# Altium project PCB_Project.PrjPcb
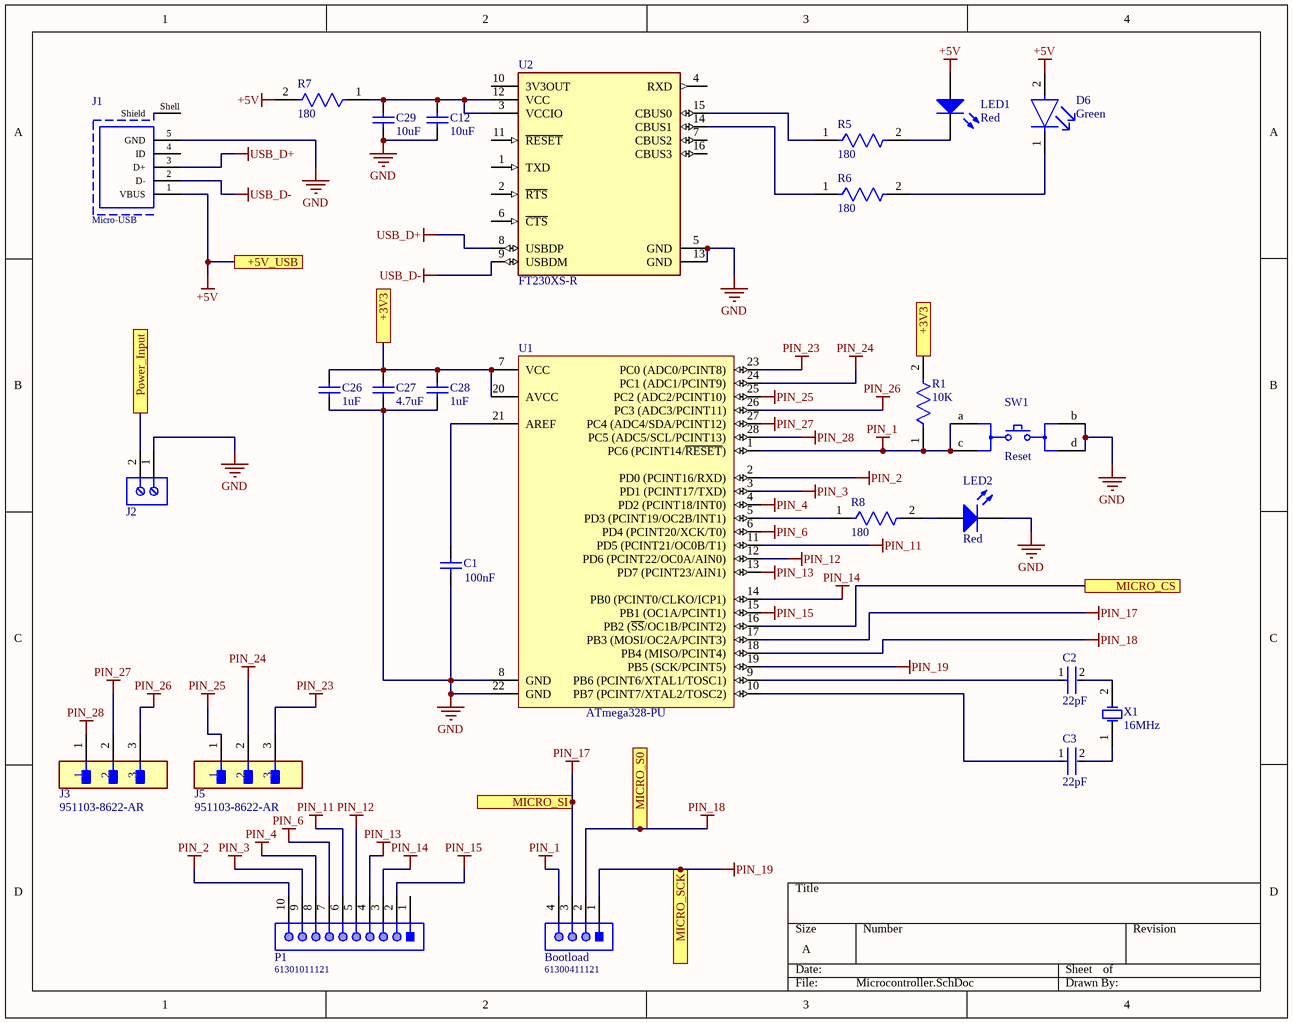
[diagram p0: Microcontroller.SchDoc]
4 sheets, 61 parts. Net scope: flat (ports and power ports of the same name join across sheets).
Board file: PCB1.PcbDoc
Sheets:
  Microcontroller.SchDoc
  Peripherals.SchDoc
  Power Delivery.SchDoc
  WiFi.SchDoc

## Sheet Microcontroller.SchDoc
size A

### Parts
Bootload  61300411121  [61300411121]
C1  100nF  [CAPC2013X140X50NL20T25]
C2  22pF  [FP-C0805C-DN-MFG]
C3  22pF  [FP-C0805C-DN-MFG]
C12  10uF  [CAPC2013X115X51LL20T26]
C26  1uF  [CAPC2013X94X50LL20T25]
C27  4.7uF  [CAPC2013X140X50LL20T25]
C28  1uF  [CAPC2013X94X50LL20T25]
C29  10uF  [CAPC2013X115X51LL20T26]
D6  Green  [FP-APTD3216CGCK-MFG]
J1  Micro-USB  [629105150921]
J2  (no value)  [691214110002]
J3  951103-8622-AR  [FP-951103-8622-AR-MFG]
J5  951103-8622-AR  [FP-951103-8622-AR-MFG]
LED1  Red  [0603_A]
LED2  Red  [0603_A]
P1  61301011121  [61301011121]
R1  10K  [FP-CRCW0805-e3-IPC_A]
R5  180  [FP-CR0805-MFG]
R6  180  [FP-CR0805-MFG]
R7  180  [FP-CR0805-MFG]
R8  180  [FP-CR0805-MFG]
SW1  Reset  [FP-ESE-20C421-MFG]
U1  ATmega328-PU  [28P3]
U2  FT230XS-R  [FP-SSOP-16-MFG]
X1  16MHz  [FOX-FOXSDLF160-20_V]

### Ports
+3V3, +5V_USB, MICRO_CS, MICRO_S0, MICRO_SCK, MICRO_SI, Power_Input

### Nets
+3V3: C26.2 C27.2 C28.2 R1.2 U1.7(VCC) U1.20(AVCC) ; port +3V3
+5V: D6.2(A) J1.1(VBUS) LED1.2(A) R7.2 ; port +5V_USB
GND: C1.1 C12.1 C26.1 C27.1 C28.1 C29.1 J1.5(GND) J2.1 LED2.1(K) SW1.b SW1.d U1.8(GND) U1.22(GND) U2.5(GND) U2.13(GND)
PIN_1: Bootload.4 R1.1 SW1.a SW1.c U1.1(PC6_(PCINT14/~{RESET}))
PIN_2: P1.10 U1.2(PD0_(PCINT16/RXD))
PIN_3: P1.9 U1.3(PD1_(PCINT17/TXD))
PIN_4: P1.8 U1.4(PD2_(PCINT18/INT0))
PIN_6: P1.7 U1.6(PD4_(PCINT20/XCK/T0))
PIN_11: P1.6 U1.11(PD5_(PCINT21/OC0B/T1))
PIN_12: P1.5 U1.12(PD6_(PCINT22/OC0A/AIN0))
PIN_13: P1.4 U1.13(PD7_(PCINT23/AIN1))
PIN_14: P1.3 U1.14(PB0_(PCINT0/CLKO/ICP1))
PIN_15: P1.2 U1.15(PB1_(OC1A/PCINT1))
PIN_17: Bootload.3 U1.17(PB3_(MOSI/OC2A/PCINT3)) ; port MICRO_SI
PIN_18: Bootload.2 U1.18(PB4_(MISO/PCINT4)) ; port MICRO_S0
PIN_19: Bootload.1 U1.19(PB5_(SCK/PCINT5)) ; port MICRO_SCK
PIN_23: J5.3 U1.23(PC0_(ADC0/PCINT8))
PIN_24: J5.2 U1.24(PC1_(ADC1/PCINT9))
PIN_25: J5.1 U1.25(PC2_(ADC2/PCINT10))
PIN_26: J3.3 U1.26(PC3_(ADC3/PCINT11))
PIN_27: J3.2 U1.27(PC4_(ADC4/SDA/PCINT12))
PIN_28: J3.1 U1.28(PC5_(ADC5/SCL/PCINT13))
USB_D+: J1.3(D+) U2.8(USBDP)
USB_D-: J1.2(D-) U2.9(USBDM)
VIN: J2.2 ; port Power_Input
NetC1_2: C1.2 U1.21(AREF)
NetC2_1: C2.1 U1.9(PB6_(PCINT6/XTAL1/TOSC1))
NetC2_2: C2.2 X1.2(X2)
NetC3_1: C3.1 U1.10(PB7_(PCINT7/XTAL2/TOSC2))
NetC3_2: C3.2 X1.1(X1)
NetC12_2: C12.2 C29.2 R7.1 U2.3(VCCIO) U2.12(VCC)
NetD6_1: D6.1(C) R6.2
NetLED1_1: LED1.1(K) R5.2
NetLED2_2: LED2.2(A) R8.2
NetR5_1: R5.1 U2.15(CBUS0)
NetR6_1: R6.1 U2.14(CBUS1)
NetR8_1: R8.1 U1.5(PD3_(PCINT19/OC2B/INT1))
NetU1_16: U1.16(PB2_(~{SS}/OC1B/PCINT2)) ; port MICRO_CS

Not connected (* = marked no-connect by the designer): J1 4(ID) Shell(Shield); P1 1; U2 1(TXD) 2(~{RTS}) 4(RXD) 6(~{CTS}) 7(CBUS2) 10(3V3OUT) 11(~{RESET}) 16(CBUS3)

### Library data of the parts
Bootload = CMP-1502-01064-1: THT Vertical Pin Header WR-PHD, Pitch 2.54 mm, Single Row, 4 pins; Manufacturer: Wurth Elektronik; Withstanding Voltage: 500VAC; Rated Current: 3A; Working Voltage: 250VAC; Pin Number: 4; Gender: Male; Contact Resistance: 20mOhm; Pitch: 2.54mm; Manufacturer URL: http://www.we-online.de; Operating Temperature: -40to105degC; Packaging: Bag; Mounting Technology: THT; Package Reference: 61300411121; Datasheet URL: https://katalog.we-online.de/em/datasheet/6130xx11121.pdf; Publisher: WurthElektronik; Part Number: 61300411121; Row Number: Single; Orientation: Vertical
C1 = CMP-2007-04629-1: Part Number: 08055C104K4Z2A; Manufacturer: AVX Interconnect / Elco
C2 C3 = CMP-2007-00448-2: CAP CER 22PF 100V 5% NP0 0805; Manufacturer Part Number: C0805C220J1GACTU; Manufacturer: KEMET; Material: Ceramic; Temperature Coefficient: 30ppm/°C; Tolerance: 0.05; Temperature Characteristic: C0G; Value: 22 pF; RoHS: TRUE; ComponentLink2URL: https://content.kemet.com/datasheets/KEM_C1003_C0G_SMD.pdf; Capacitance: 22 pF; Mouser Description: Multilayer Ceramic Capacitor, C Series, 22 Pf, - 5%, C0g / Np0, 100 V, 0805 [2012 Metric] Rohs Compliant: Yes; Digikey Description: CAP CER 22PF 100V 5% NP0 0805; Octopart: https://octopart.com/c0805c220j1gactu-kemet-3791395; Device Class L3: Ceramic Capacitors; Device Class L2: Capacitors; Voltage Rating: 100 V; Temperature Range Low: -55°C; Ipc Land Pattern Name: CAPC200125X78; Lead Free: Yes; ComponentLink2Description: Datasheet; Category: Cap; Temperature: -55°C to +125°C; Package: C0805C-DN; Device Class L1: Passive Components; Temperature Range High: +125°C; Height: 0.88mm; Automotive: No
C12 C29 = CMP-2007-04884-1: Manufacturer: AVX Interconnect / Elco; Part Number: 08056C106KAT2A
C26 C28 = CMP-2007-04237-1: Manufacturer: AVX Interconnect / Elco; Part Number: 08053C105K4T2A
C27 = CMP-1036-04896-2: Manufacturer: AVX Interconnect / Elco; Part Number: 08053D475MAT2A
D6 = CMP-2000-05792-2: LED GREEN CLEAR 2SMD; Forward Voltage: 2.1V; Forward Current: 20mA; Luminous Intensity: 300mcd; Number of LEDs: 1; Dominant Wavelength: 570nm; Viewing Angle: 50°; Lead Free: Lead Free; Lens Color: Clear; Mount: Surface Mount; Package Quantity: 2000; Height: 1.8mm; Number of Pins: 2; Test Current: 20mA; Case Code (Metric): 3216; Case/Package: 1206; Case Code (Imperial): 1206; Illumination Color: Green; Color: Green; Width: 1.6mm; Packaging: Tape and Reel; Min Operating Temperature: -40°C; Lens Style: Clear; Max Operating Temperature: 85°C; Length: 3.2mm
J1 = CMP-1502-03249-1: Micro USB 2.0 Type AB Receptacle WR-COM, Horizontal, SMT; Manufacturer: Wurth Elektronik; Rated Current: 1.8A; Contact Resistance: 30mOhm; Working Voltage: 30VAC; Publisher: WurthElektronik; Part Number: 629105150921; Operating Temperature: -40to85degC; Gender: Receptacle; Packaging: TapeandReel; Connector Type: MicroUSB2.0TypeAB; Datasheet URL: https://katalog.we-online.de/em/datasheet/629105150921.pdf; Mounting Technology: SMT; Orientation: Horizontal; Package Reference: 629105150921; Manufacturer URL: http://www.we-online.de
J2 = CMP-1502-02464-1: Serie 2141 - 3.50 mm Horizontal Entry Modular with Rising Cage Clamp WR-TBL, 2 pin; Manufacturer: Wurth Elektronik; Pin Number: 2; Pitch: 3.50mm; Datasheet URL: http://katalog.we-online.de/em/datasheet/6912141100xx.pdf; Packaging: Box; Mounting Technology: THT; Package Reference: 691214110002; Manufacturer URL: http://www.we-online.de; Part Number: 691214110002; Publisher: WurthElektronik; Operating Temperature: -40to105degC
J3 J5 = CMP-05379-000003-1: CONN HEADER VERT 3POS 2MM; Manufacturer: 3M; Conn Gender: Male; Current Rating: 2A; Number Of Contacts: 3; Conn Orientation: Straight; Digikey Description: CONN HEADER VERT 3POS 2MM; Device Class L3: unset; Category: Conn; Height: 6.3mm; Manufacturer Part Number: 951103-8622-AR; RoHS: TRUE; Contact Material: Gold,Nickel; ComponentLink2Description: Datasheet; Temperature Range Low: -55°C; Device Class L1: Connectors; Pitch: 2mm; Mouser Description: Header; PinStrip; CopperAlloy; HighTempThermoplastic; 3Cnts; 1A; RtAngle; 951Series; Octopart: https://octopart.com/951103-8622-ar-3m-14400669; Package: 951103-8622-AR; Lead Free: Yes; Device Class L2: Headers and Wire Housings; Temperature Range High: +125°C; ComponentLink2URL: http://multimedia.3m.com/mws/media/1400506O/3m-pin-strip-header-951-series-78-5100-2653-3.pdf; Automotive: No; Temperature: -55°C to +125°C; Number Of Rows: 1
LED1 LED2 = CMP-1426-00001-1: SMD mono-color Chip LED, WL-SMCW, Red; Manufacturer: Wuerth Elektronik; PartNumber: 150060RS75000; Color: Red; PackageReference: 0603_A; ComponentLink2URL: http://katalog.we-online.com/led/datasheet/150060RS75000.pdf; ComponentLink1URL: http://www.we-online.com; ComponentLink1Description: Manufacturer URL; ComponentLink2Description: Datasheet
P1 = CMP-1502-01082-1: THT Vertical Pin Header WR-PHD, Pitch 2.54 mm, Single Row, 10 pins; Manufacturer: Wurth Elektronik; Contact Resistance: 20mOhm; Rated Current: 3A; Pitch: 2.54mm; Gender: Male; Pin Number: 10; Working Voltage: 250VAC; Withstanding Voltage: 500VAC; Manufacturer URL: http://www.we-online.de; Operating Temperature: -40to105degC; Datasheet URL: https://katalog.we-online.de/em/datasheet/6130xx11121.pdf; Row Number: Single; Orientation: Vertical; Part Number: 61301011121; Packaging: Bag; Package Reference: 61301011121; Mounting Technology: THT; Publisher: WurthElektronik
R1 = CMP-2001-04908-2: RES Thick Film, 10kΩ, 1%, 0.125W, 100ppm/°C, 0805; Resistance: 10kR; Voltage Rating (DC): 150V; Power Rating: 125mW; Weight: 0.000194oz; Package Quantity: 5000; Military Standard: Not; Max Operating Temperature: 155°C; Temperature Coefficient: 100ppm/°C; Contact Plating: Tin; Width: 1.25mm; Height: 0.45mm; Radiation Hardening: No; Tolerance: 1%; Min Operating Temperature: -55°C; Voltage Rating: 150V; Length: 2mm; Depth: 1.25mm; Termination: SMD/SMT; Packaging: Tape and Reel; Case/Package: 0805; Case Code (Metric): 2012; Lead Free: Lead Free; Case Code (Imperial): 0805; Composition: Thick Film
R5-R8 = CMP-07231-003557-1: Thick Film Chip Resistors 0805 180Ω 0.125W 5% 200ppm/°C; Voltage Rating: 150V; Power Rating: 125mW; Resistance: 180R; Radiation Hardening: No; Military Standard: Not; Case Code (Imperial): 0805; Length: 2mm; Termination: SMD/SMT; Thickness: 508um; Case Code (Metric): 2012; Packaging: Tape and Reel; Temperature Coefficient: 200ppm/°C; Max Operating Temperature: 155°C; Package Quantity: 5000; Case/Package: 0805; Contact Plating: Tin; Tolerance: 5%; Width: 1.25mm; Composition: Thick Film; Depth: 1.25mm; Mount: Surface Mount; Height: 0.5mm; Min Operating Temperature: -55°C
SW1 = CMP-05613-000006-1: SWITCH PUSH SPST-NO 0.1A 14V; Current Rating: 100mA; Switch Function: Off-Mom; Throw Configuration: SPST; Actuator Type: Lever; Operating Force: 4N; Actuator Length: 5.5mm; Series: ESE20C; Package Quantity: 1200; Radiation Hardening: No; Max Voltage Rating (DC): 14V; Voltage Rating (DC): 14V; Max Operating Temperature: 80°C; Lead Free: Lead Free; Mount: Through Hole; Termination: PC Pin; Packaging: Bulk; Min Operating Temperature: -30°C; RoHS Compliant: Yes; Contact Current Rating: 100mA; REACH SVHC: No SVHC; Orientation: Straight
U1 = CMP-0095-00015-2: 8-bit AVR Microcontroller, 32KB Flash, 1KB EEPROM, 2KB SRAM, 28-pin PDIP, Industrial Grade (-40°C to 85°C); ComponentLink3Description: ATmega48A/48PA/88A/88PA/168A/168PA/328/328P Summary; RevisionNote: DatasheetVersion updated. URLs added.; DatasheetVersion: revD, May-2011; ComponentLink1URL: http://www.atmel.com/; PackageVersion: revB, Sep-2001; PackageDescription: 28-lead (0.300"/7.62mm Wide) Plastic Dual Inline Package (PDIP); PackageReference: 28P3; ComponentLink1Description: Manufacturer URL; ComponentLink2Description: ATmega48A/48PA/88A/88PA/168A/168PA/328/328P Datasheet; ComponentLink3URL: http://www.atmel.com/dyn/resources/prod_documents/8271S.pdf; ComponentLink2URL: http://www.atmel.com/dyn/resources/prod_documents/8271.pdf
U2 = CMP-0248-00026-3: IC USB SERIAL BASIC UART 16SSOP; Min Supply Voltage: 2.97V; Data Rate: 12Mbps; Operating Supply Voltage: 5V; Number of Channels: 1; Max Supply Voltage: 5.5V; Operating Supply Current: 8mA; Case/Package: SSOP; Length: 5mm; Interface: UART; Mount: Surface Mount; Number of Pins: 16; Packaging: Tape and Reel; Weight: 0.004586oz; Min Operating Temperature: -40°C; Width: 0.157inch; Height: 0.059inch; Package Quantity: 3000; Max Operating Temperature: 85°C
X1 = CMP-1749-00001-1: Resistance Weld SMD Crystal, 16 MHz, +/- 30 ppm, 20 pF, -20 to 70 degC, 2-Pin SMD, RoHS, Tape and Reel; Output Current: 3 mA; Case\Package: SOT-553-6; Min Supply Voltage (DC): 4 V; Max Supply Voltage: 3.3 V; Min Supply Voltage: 1.4 V; Interface: I2C; Max Supply Voltage (DC): 6 V; ComponentLink2Description: Datasheet; REACH SVHC: No SVHC; ComponentLink1URL: http://www.foxonline.com/; ComponentLink2URL: http://foxonline.com/pdfs/hc49sdlf.pdf; Pins: 6; Packaging: Cut Tape; ComponentLink1Description: Manufacturer URL; Weight: 9.9E-05 oz; Length: 1.6 mm; RoHSCompliant: true; Min Operating Temperature: -55 degC; Radiation Hardening: No; PackageDescription: 2-Pin Surface Mount Device, Body 5 x 11.7 mm, Height 4.5 mm; Package Quantity: 1; Width: 1.2 mm; DatasheetVersion: Mar-15; Max Operating Temperature: 150 degC; Mount: Surface Mount; PackageReference: FOX-FOXSDLF160-20; Height: 0.55 mm

## Sheet Peripherals.SchDoc
size A3
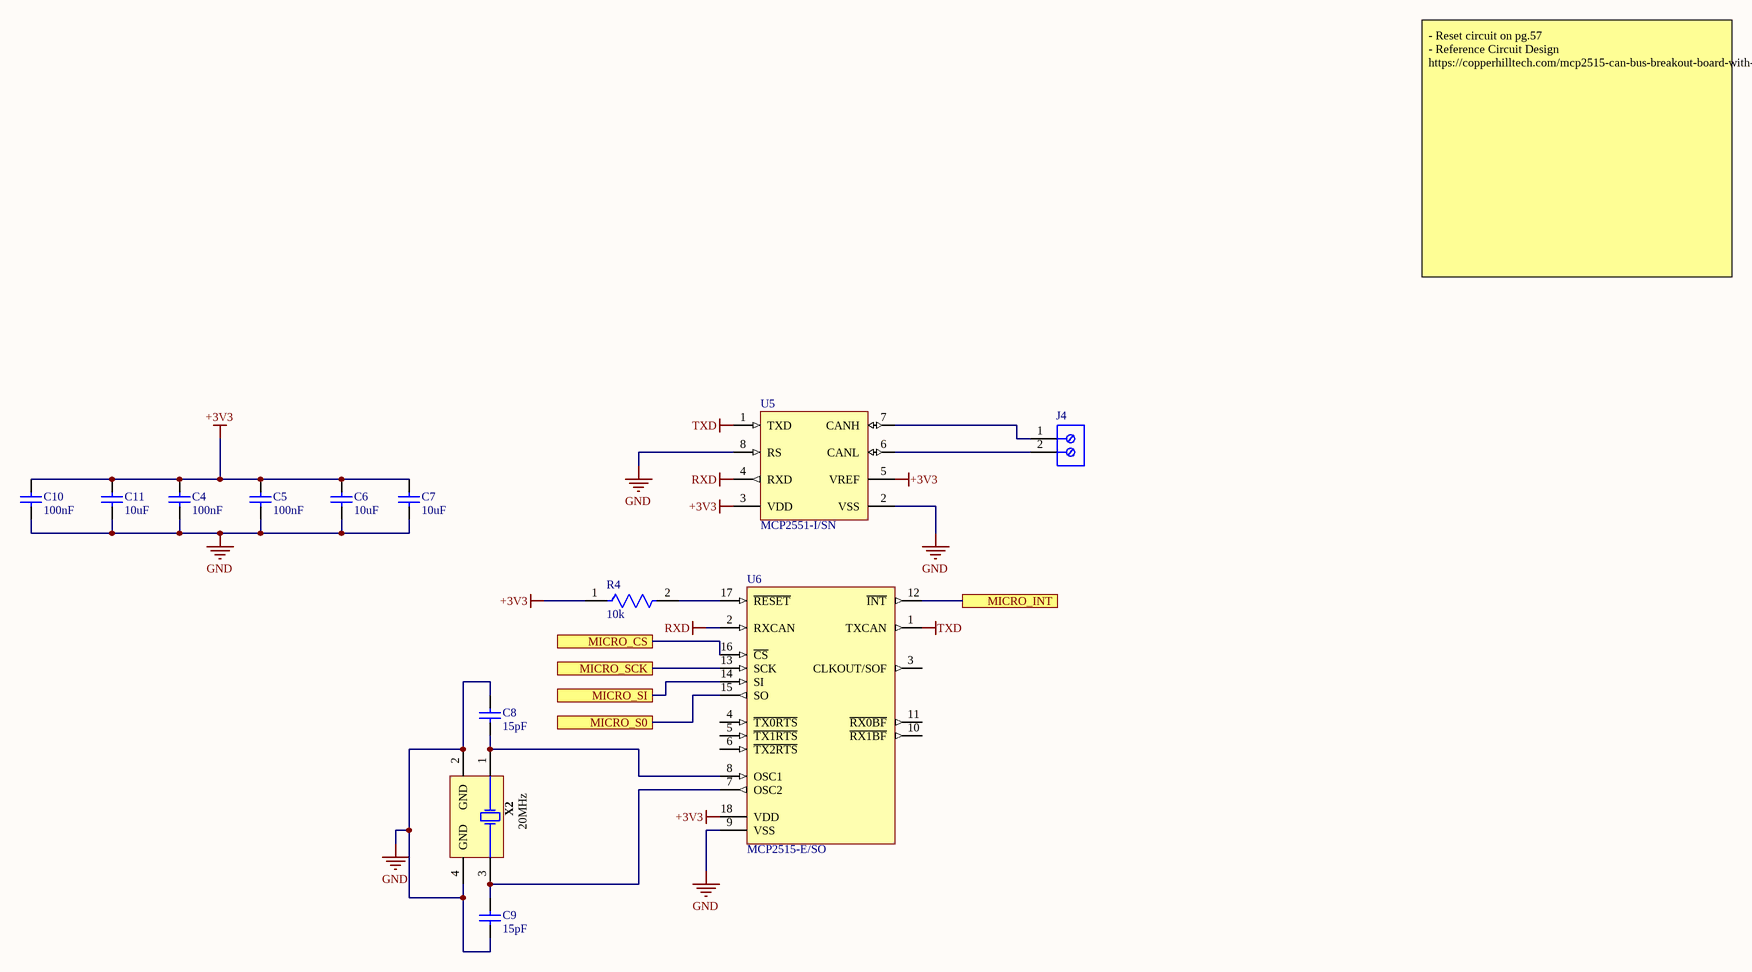
[diagram p1: Peripherals.SchDoc]

### Parts
C4  100nF  [CAPC2013X94X50ML20T25]
C5  100nF  [CAPC2013X94X50ML20T25]
C6  10uF  [CAPC2013X115X51LL20T26]
C7  10uF  [CAPC2013X115X51LL20T26]
C8  15pF  [CAPC2013X94X50NL20T25]
C9  15pF  [CAPC2013X94X50NL20T25]
C10  100nF  [CAPC2013X94X50ML20T25]
C11  10uF  [CAPC2013X115X51LL20T26]
J4  (no value)  [691214110002]
R4  10k  [FP-AC0805-MFG]
U5  MCP2551-I/SN  [MCHP-SN8_V]
U6  MCP2515-E/SO  [SOIC-SO18_M]
X2  20MHz  [TXC-7B-4_V]

### Ports
MICRO_CS, MICRO_INT, MICRO_S0, MICRO_SCK, MICRO_SI

### Nets
+3V3: C4.2 C5.2 C6.2 C7.2 C10.2 C11.2 R4.1 U5.3(VDD) U5.5(VREF) U6.18(VDD)
GND: C4.1 C5.1 C6.1 C7.1 C8.2 C9.1 C10.1 C11.1 U5.2(VSS) U5.8(RS) U6.9(VSS) X2.2(GND) X2.4(GND)
PIN_17: U6.14(SI) ; port MICRO_SI
PIN_18: U6.15(SO) ; port MICRO_S0
PIN_19: U6.13(SCK) ; port MICRO_SCK
RXD: U5.4(RXD) U6.2(RXCAN)
TXD: U5.1(TXD) U6.1(TXCAN)
NetC8_1: C8.1 U6.8(OSC1) X2.1(X1)
NetC9_2: C9.2 U6.7(OSC2) X2.3(X2)
NetJ4_1: J4.1 U5.7(CANH)
NetJ4_2: J4.2 U5.6(CANL)
NetR4_2: R4.2 U6.17(~{RESET})
NetU1_16: U6.16(~{CS}) ; port MICRO_CS
NetU6_12: U6.12(~{INT}) ; port MICRO_INT

Not connected (* = marked no-connect by the designer): U6 3(CLKOUT/SOF) 4(~{TX0RTS}) 5(~{TX1RTS}) 6(~{TX2RTS}) 10(~{RX1BF}) 11(~{RX0BF})

### Notes on the sheet
- - Reset circuit on pg.57
  - Reference Circuit Design https://copperhilltech.com/mcp2515-can-bus-breakout-board-with-spi-interface/
- Title
- Size:
- Date:
- A3
- Number:
- Time:
- Revision:
- Sheet
- of
- File:

### Library data of the parts
C4 C5 C10 = CMP-1036-04427-2: Manufacturer: AVX Interconnect / Elco; Part Number: 08051C104JAT2A
C6 C7 C11 = CMP-2007-04884-1: as C12 on sheet Microcontroller
C8 C9 = CMP-1036-01049-2: Part Number: 08051A150FAT2A; Manufacturer: AVX Interconnect / Elco
J4 = CMP-1502-02464-1: as J2 on sheet Microcontroller; Datasheet URL: http://katalog.we-online.de/em/datasheet/6912141100xx.pdf; Packaging: Box; Mounting Technology: THT; Package Reference: 691214110002; Manufacturer URL: http://www.we-online.de; Part Number: 691214110002; Publisher: WurthElektronik; Operating Temperature: -40to105degC
R4 = CMP-2001-04480-2: RES SMD 10K OHM 1% 1/8W 0805; Manufacturer Part Number: AC0805FR-0710KL; Manufacturer: Yageo; Voltage Rating: 150V; Automotive Grade: Grade 0; Resistance: 10KΩ; Value: 10KΩ; Tolerance: 0.01; Temperature: -55°C to +155°C; Device Class L2: Resistors; RoHS: TRUE; Octopart: https://octopart.com/ac0805fr-0710kl-yageo-21711112; Ipc Land Pattern Name: RESC200125X50; ComponentLink2Description: Datasheet; Footprint Url: http://www.yageo.com/exep/pages/download/literatures/PYu-R_Mount_10.pdf; Temperature Range High: +155°C; Digikey Description: RES SMD 10K OHM 1% 1/8W 0805; Package: AC0805; Automotive: Yes; Mouser Description: Res Thick Film 0805 10K Ohm 1% 0.125W(1/8W) ±100ppm/C Epoxy Pad SMD Automotive T/R; Series: AC; ComponentLink2URL: http://www.yageo.com/documents/recent/PYu-AC_51_RoHS_L_6.pdf; Composition: Thick Film; Device Class L3: Chip SMD Resistors; Temperature Range Low: -55°C; Power Rating: 1/8W; Device Class L1: Passive Components; Height: 0.6mm; Lead Free: Yes; Category: Res
U5 = CMP-0186-00138-3: High-Speed CAN Transceiver, / 1 Mb/s, 4.5 to 5.5 V, 8-Pin SOIC (SN), Industrial Temperature, RoHS, Tube; Manufacturer: Microchip; RoHSCompliant: true; PackageReference: SN8; ComponentLink1URL: http://www.microchip.com/; DatasheetVersion: Rev. F, 07/2010; ComponentLink2Description: Datasheet; ComponentLink2URL: http://ww1.microchip.com/downloads/en/DeviceDoc/21667f.pdf; ComponentLink3Description: Package Specification; PackageDescription: 8-Pin Small Outline Integrated Circuit, Body 4.9 x 3.9 mm, Pitch 1.27 mm; ComponentLink1Description: Manufacturer URL; Mounting Technology: Surface Mount; ComponentLink3URL: http://www.microchip.com/stellent/groups/techpub_sg/documents/packagingspec/en012702.pdf
U6 = CMP-0186-00035-2: Stand-Alone CAN Controller With SPI Interface, 18-Pin SOIC, Extended Temperature; RevisionNote: URLs added. DatasheetVersion updated.; DatasheetVersion: revF, Oct-2010; ComponentLink2Description: Datasheet; ComponentLink3Description: Package Specification; ComponentLink1Description: Manufacturer URL; PackageReference: SOIC-SO18; PackageDescription: 18-Lead Plastic Small Outline (SO) - Wide 7.50mm Body [SOIC]; PackageVersion: revBB, Aug-2009; ComponentLink1URL: http://www.microchip.com/; ComponentLink3URL: http://www.microchip.com/stellent/groups/techpub_sg/documents/packagingspec/en012702.pdf; ComponentLink2URL: http://ww1.microchip.com/downloads/en/DeviceDoc/21801f.pdf; Code_JEDEC: MS-013
X2 = CMP-1774-00008-1: SMD Seam Sealing Crystal, 20 MHz, +/- 30 ppm, 18 pF, -10 to 70 degC, 4-Pin SMD, RoHS, Tape and Reel; Peak Reverse Current: 2 uA; Recovery Time: 5 ns; Elements: 2; Max Power Dissipation: 200 mW; Forward Current: 200 mA; Case\Package: TO-236-3; Forward Voltage: 800 mV; Max Surge Current: 600 mA; Element Configuration: Common Cathode; Width: 0.85 mm; Length: 1.7 mm; Pins: 3; RoHSCompliant: true; Min Operating Temperature: -65 degC; Mount: Surface Mount; Height: 0.8 mm; Packaging: Tape and Reel; PackageReference: 7B-4; Package Quantity: 3000; Max Operating Temperature: 125 degC; Radiation Hardening: No; PackageDescription: 4-Pin Surface Mount Device, Body 5 x 3.2 mm, Pitch 3.7 mm; ComponentLink1Description: Datasheet; REACH SVHC: No SVHC; ComponentLink1URL: http://www.txccorp.com/download/products/quartz_crystals/2015TXC_7B_19.pdf; DatasheetVersion: Jul-15

## Sheet Power Delivery.SchDoc
size A3
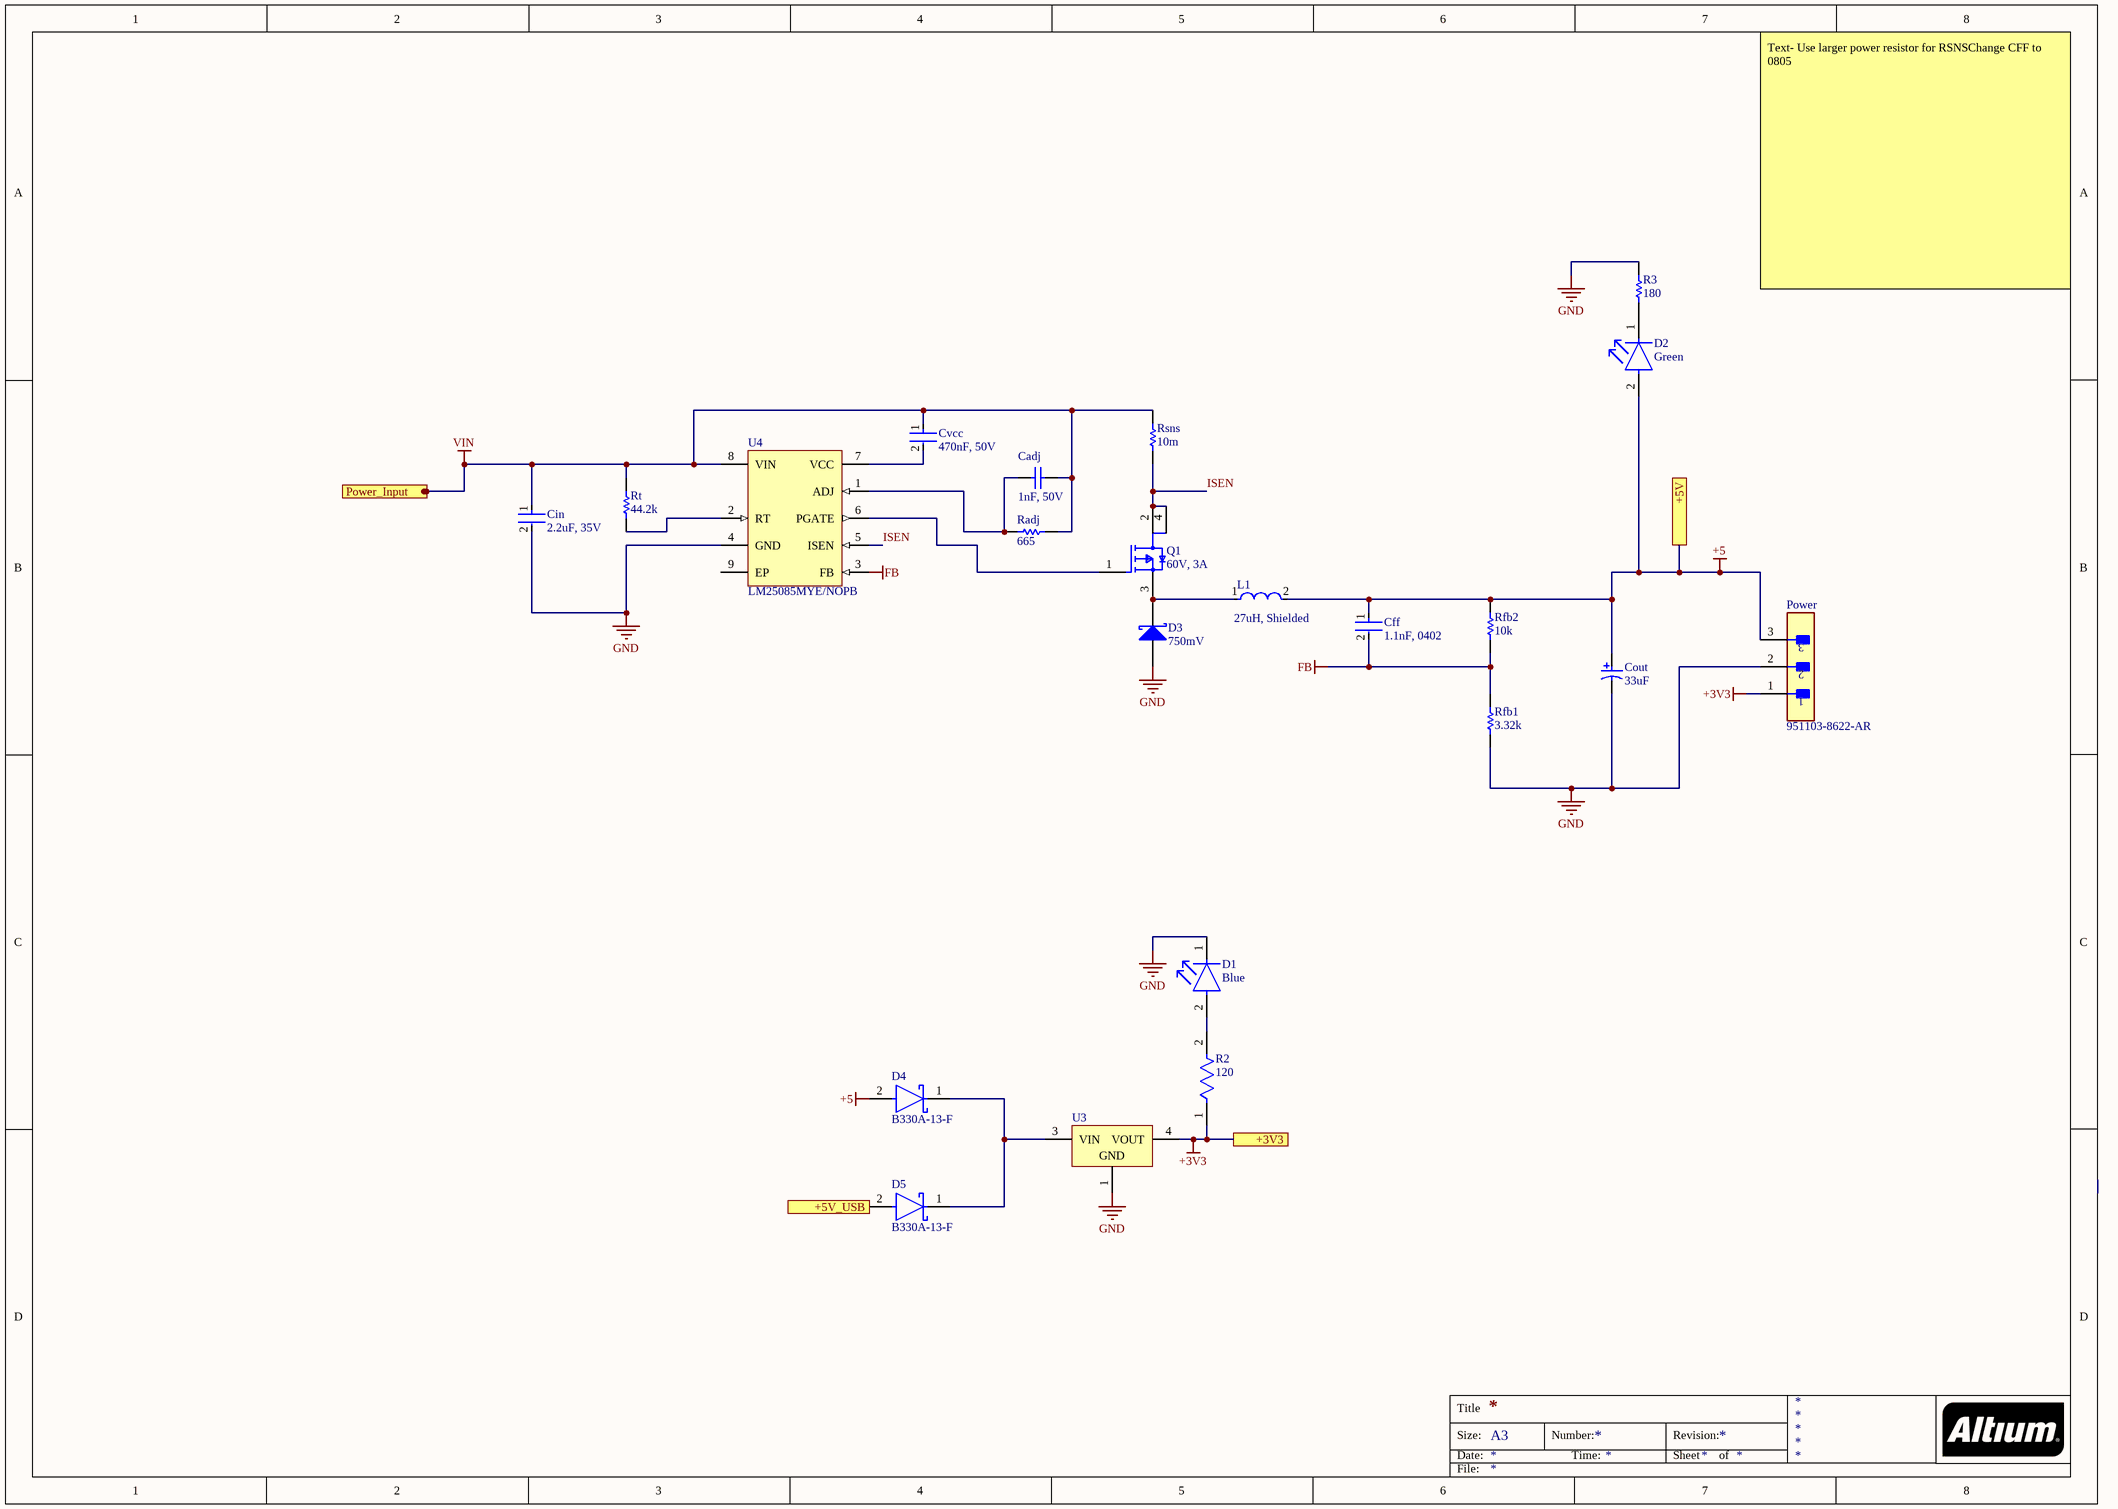
[diagram p2: Power Delivery.SchDoc]

### Parts
Cadj  1nF, 50V  [CAPC2013X94X50ML20T25]
Cff  1.1nF, 0402  [FP-C0402-BB-MFG]
Cin  2.2uF, 35V  [FP-C2012-125-0_2-IPC_B]
Cout  33uF  [NIC-CAPA2-6.3X5.8_V]
Cvcc  470nF, 50V  [FP-GCM21B-0_15-IPC_A]
D1  Blue  [FP-LTST-C191TBKT-MFG]
D2  Green  [FP-6_541-5056_01-4-MFG]
D3  750mV  [DIOD-SOD-323-2_V]
D4  B330A-13-F  [FP-SMA-MFG]
D5  B330A-13-F  [FP-SMA-MFG]
L1  27uH, Shielded  [FP-SRR1260-MFG]
Power  951103-8622-AR  [FP-951103-8622-AR-MFG]
Q1  60V, 3A  [FP-SOT223-IPC_C]
R2  120  [FP-AC0805-MFG]
R3  180  [RESC2013X70X40ML20T20]
Radj  665  [RESC2013X70X40LL20T20]
Rfb1  3.32k  [RESC2013X55X40NL15T20]
Rfb2  10k  [RESC2013X60X35NL10T20]
Rsns  10m  [RESC2013X60X35LL10T20]
Rt  44.2k  [RESC2013X50X30LL20T20]
U3  (no value)  [TO-252_N]
U4  LM25085MYE/NOPB  [DGN0008A_L]

### Ports
+3V3, +5V, +5V_USB, Power_Input

### Nets
+3V3: Power.1 R2.1 U3.4(VOUT) ; port +3V3
+5: Cff.1 Cout.1 D2.2(A) D4.2(A) L1.2 Power.3 Rfb2.2 ; port +5V
+5V: D5.2(A) ; port +5V_USB
FB: Cff.2 Rfb1.2 Rfb2.1 U4.3(FB)
GND: Cin.2 Cout.2 D1.1(C) D3.1(A) Power.2 R3.2 Rfb1.1 U3.1(GND) U4.4(GND)
VIN: Cadj.1 Cin.1 Cvcc.1 Radj.2 Rsns.2 Rt.2 U4.8(VIN) ; port Power_Input
ISEN: Q1.2(D) Q1.4(D) Rsns.1 U4.5(ISEN)
NetCadj_2: Cadj.2 Radj.1 U4.1(ADJ)
NetCvcc_2: Cvcc.2 U4.7(VCC)
NetD1_2: D1.2(A) R2.2
NetD2_1: D2.1(C) R3.1
NetD3_2: D3.2(K) L1.1 Q1.3(S)
NetD4_1: D4.1(C) D5.1(C) U3.3(VIN)
NetQ1_1: Q1.1(G) U4.6(PGATE)
NetRt_1: Rt.1 U4.2(RT)

Not connected (* = marked no-connect by the designer): U4 9(EP)

### Notes on the sheet
- Text- Use larger power resistor for RSNSChange CFF to 0805
- Title
- Size:
- Date:
- A3
- Number:
- Time:
- Revision:
- Sheet
- of
- File:

### Library data of the parts
Cadj = CMP-2007-04448-1: Part Number: 08055F102KAT2A; Manufacturer: AVX Interconnect / Elco
Cff = CMP-1034-01638-3: CAP CER 1100PF 50V C0G/NP0 0402; Manufacturer Part Number: C0402C112J5GACTU; Manufacturer: Kemet; Tolerance: 0.05; Capacitance: 1,100 pF; Temperature Characteristic: C0G; Value: 1,100 pF; Temperature Coefficient: 15%; Height: 0.55mm; Lead Free: Yes; ComponentLink2URL: https://content.kemet.com/datasheets/KEM_C1002_X7R_SMD.pdf; Mouser Description: Cap Ceramic 0.0011uF 50V C0G 5% SMD 0402 125°C Paper T/R; Temperature Range Low: -55°C; Octopart: https://octopart.com/c0402c112j5gactu-kemet-19757367; Device Class L1: Passive Components; Package: C0402-BB; Category: Cap; RoHS: TRUE; Ipc Land Pattern Name: CAPC10050X50; Temperature: -55°C to +125°C; Device Class L2: Capacitors; ComponentLink2Description: Datasheet; Material: Ceramic; Voltage Rating: 50 V; Digikey Description: CAP CER 1100PF 50V C0G/NP0 0402; Automotive: No; Temperature Range High: +125°C; Device Class L3: Ceramic Capacitors
Cin = CMP-08246-002978-1: Multilayer Ceramic Capacitors 2.2μF ±10% 35V X6S SMD 0805; Termination: SMD/SMT; Dielectric: X6S; Mount: Surface Mount; Case/Package: 0805; Package Quantity: 2000; Width: 0.049inch; Voltage Rating: 35V; Max Operating Temperature: 105°C; Dielectric Material: Ceramic; Weight: 0.000194oz; Tolerance: 10%; Capacitance: 2.2uF; Packaging: Tape and Reel; Series: C; Height: 1.25mm; Min Operating Temperature: -55°C; Case Code (Metric): 2012; RoHS Compliant: Yes; Thickness: 0.057inch; Voltage Rating (DC): 35V; Lead Free: Lead Free; Length: 0.079inch; Case Code (Imperial): 0805
Cout = CMP-0687-00040-1: Aluminum Electrolytic Capacitor, UD Series, Low Impedance, 33 uF, 16 V, + / - 20%, -55 to 105 degC, Chip Type, 6.3 x 5.8 mm D x L, Pb-Free, Reel; PartNumber: UUD1C330MCL1GS; Manufacturer: Nichicon; Tolerance Rated Capacitance: -20 to 20%; Endurance Time: 2000 h; Impedance: 0.44 Ohm; Packing: Dia382mm Reel; Rated Ripple Current (at 100kHz): 230 mA; Rated Voltage: 16 V; ComponentLink3Description: Package Specification; ComponentLink2Description: Datasheet; ComponentLink1Description: Manufacturer URL; PackageDescription: 2-Pin Surface Mount Device, Diameter 6.3 mm, Height 5.8 mm, Pitch 5.4 mm; ComponentLink2URL: http://products.nichicon.co.jp/en/pdf/XJA043/e-ud.pdf; PackageReference: CAPAE-D6.3H5.8; ComponentLink1URL: http://www.nichicon.co.jp/; Length: 5.8 mm; RoHS: TRUE; ComponentLink3URL: http://products.nichicon.co.jp/en/pdf/XJA043/e-ud.pdf; Diameter: 6.3 mm; DatasheetVersion: 08/2012; Mounting Technology: Surface Mount; Rated Capacitance: 33 uF
Cvcc = CMP-2007-03360-2: Ceramic Capacitor for Automotive 470nF ±10% 50VDC X7R 0805 Embossed T/R; Case Code (Imperial): 0805; Length: 2mm; Thickness: 0.055inch; Width: 0.049inch; Dielectric: X7R; Termination: SMD/SMT; Voltage Rating (DC): 50V; Case Code (Metric): 2012; Packaging: Tape and Reel; Capacitance: 470nF; Case/Package: 0805; Radiation Hardening: No; Depth: 1.25mm; Max Operating Temperature: 125°C; Tolerance: 10%; Package Quantity: 10000; Height: 1.25mm; Mount: Surface Mount; Ratings: AEC-Q200; Min Operating Temperature: -55°C; Voltage Rating: 50V
D1 = CMP-22017-000008-1: LED BLUE CLEAR CHIP SMD; Lens Color: Colorless; Dominant Wavelength: 475nm; Forward Current: 20mA; Wavelength: 468nm; Viewing Angle: 130°; Power Dissipation: 76mW; Luminous Intensity: 180mcd; Reverse Voltage: 5V; Number of Elements: 1; Lens Style: Diffused; Forward Voltage: 3.8V; Max Power Dissipation: 75mW; Case Code (Metric): 1608; Packaging: Tape and Reel; Case/Package: 0603; Depth: 1.6mm; Mount: Surface Mount; Lead Free: Lead Free; Min Operating Temperature: -20°C; Lens Transparency: Clear; Illumination Color: Blue; Height: 0.55mm; Test Current: 20mA; Case Code (Imperial): 0603; Max Operating Temperature: 80°C; Number of Pins: 2; Length: 0.8mm; Radiation Hardening: No; Package Quantity: 1; Number of LEDs: 1; Width: 0.8mm; Color: Blue
D2 = CMP-02520-000009-1: LED GREEN 0603 SMD; Manufacturer Part Number: TLMP1100-GS08; Manufacturer: Vishay; Max Junction Temp: +120°C; Automotive Grade: Grade 3; Reverse Voltage: 6V; Led Orientation: Top View; Forward Voltage: 2.1V; Luminous Intensity: 15mcd; Forward Current: 20mA; Colour: Pure green; Peak Emmision Wavelength: 562nm; Wavelength: 561nm; Viewing Angle: 160°; Power Dissipation: 90mW; Digikey Description: LED GREEN 0603 SMD; Package: 6.541-5056.01-4; Ambient Temperature Range High: +100°C; Height: 0.65mm; Device Class L1: Optoelectronics; Device Class L2: LEDs; Mouser Description: Standard LEDs - SMD Pure Green; Temperature Range High: +120°C; RoHS: TRUE; Ambient Temperature Range Low: -40°C; Temperature: to +120°C; ComponentLink2URL: http://www.vishay.com/docs/83173/tlmb1100.pdf; Lead Free: Yes; Octopart: https://octopart.com/tlmp1100-gs08-vishay-55433993; Automotive: Yes; Device Class L3: unset; ComponentLink2Description: Datasheet; Category: Diode
D3 = CMP-2000-07037-1: Schottky Barrier Diode, 30 V, -65 to 150 degC, 2-Pin SOD-323, RoHS, Tape and Reel; Pd - Power Dissipation: 250mW; Ir - Reverse Current: 1uA; Brand: DiodesIncorporated; Ifsm - Forward Surge Current: 0.75A; Vf - Forward Voltage: 0.8V; Unit Weight: 0.000173oz; Type: SurfaceMountSchottkyBarrierDiode; Vrrm - Repetitive Reverse Voltage: 30V; Configuration: Single; If - Forward Current: 0.1A; Mounting Style: SMD/SMT; Operating Temperature Range: -65Cto+150C; Series: SD107; Minimum Operating Temperature: -65C; Maximum Operating Temperature: +150C; Datasheet Version: Rev. 10-2, 12/2009; Termination Style: SMD/SMT; Product Category: SchottkyDiodes&Rectifiers; RoHS: True; Product: SchottkyDiodes; Package Description: 2-Pin Small Outline Diode, Body 1.7 x 1.3 mm; Package Reference: SOD-323-2; Package / Case: SOD-323; Factory Pack Quantity: 3000; Manufacturer: DiodesIncorporated; Manufacturer URL: http://www.diodes.com/; Length: 1.8mm; Packaging: Reel; Width: 1.4mm; Mounting Technology: SurfaceMount; Datasheet URL: http://www.diodes.com/_files/datasheets/ds30129.pdf; Technology: Si; Height: 1mm
D4 D5 = CMP-2000-05896-2: DIODE SCHOTTKY 30V 3A SMA; Manufacturer: Diodes; Max Junction Temp: +150°C; Standoff Height: 0.05mm; Peak Reverse Current: 0.5mA; Capacitance: 200pF; Value: 200pF; Max Surge Forward Current: 80A; Automotive Grade: Grade 0; Octopart: https://octopart.com/b330a-13-f-diodes+inc.-325808; Working Reverse Voltage: 30V; ComponentLink2URL: https://www.diodes.com/assets/Datasheets/ds30891.pdf; Dc Blocking Voltage: 30V; Reverse Voltage: 30V; Digikey Description: DIODE SCHOTTKY 30V 3A SMA; Device Class L1: Discrete Semiconductors; Temperature: -55°C to +150°C; RoHS: TRUE; Device Class L2: Diodes; Device Class L3: Schottky Diodes; Package: SMA; ComponentLink2Description: Datasheet; Automotive: Yes; Temperature Range High: +150°C; Manufacturer Part Number: B330A-13-F; Lead Free: Yes; Temperature Range Low: -55°C; Max Repetitive Reverse Voltage: 30V; Footprint Url: https://www.diodes.com/assets/Package-Files/SMA.pdf; Forward Current: 3A; Mouser Description: Schottky Diodes & Rectifiers 30V 3A; Height: 2.4mm; Category: Diode
L1 = CMP-07248-000018-1: FIXED IND 27UH 3.6A 45 MOHM SMD; Manufacturer Part Number: SRR1260-270M; Manufacturer: Bourns; Tolerance: 20%; Core Material: Ferrite; Q Factor: 26; Series Resistance: 45mΩ; Saturation Current: 3.3A; Self Resonant Frequency: 12.7MHz; Test Frequency: 2.52MHz; ComponentLink2URL: https://www.bourns.com/docs/product-datasheets/srr1260.pdf?sfvrsn=a4409aa5_15; Mouser Description: Fixed Inductors 27uH 20% SMD 1260; Temperature Range Low: -40°C; Temperature Range High: +125°C; ComponentLink2Description: Datasheet; Lead Free: Yes; Device Class L1: Passive Components; Value: 27uH; Height: 6.5mm; Rms Current: 3.6A; Category: Ind; Device Class L2: Inductors; Composition: Wirewound; RoHS: TRUE; Automotive: No; Digikey Description: FIXED IND 27UH 3.6A 45 MOHM SMD; Package: SRR1260; Device Class L3: Fixed Inductors; Inductance: 27uH; Octopart: https://octopart.com/srr1260-270m-bourns-1930921; Temperature: -40°C to +125°C
Power = CMP-05379-000003-1: as J3 on sheet Microcontroller; Digikey Description: CONN HEADER VERT 3POS 2MM; Device Class L3: unset; Category: Conn; Height: 6.3mm; Manufacturer Part Number: 951103-8622-AR; RoHS: TRUE; Contact Material: Gold,Nickel; ComponentLink2Description: Datasheet; Temperature Range Low: -55°C; Device Class L1: Connectors; Pitch: 2mm; Mouser Description: Header; PinStrip; CopperAlloy; HighTempThermoplastic; 3Cnts; 1A; RtAngle; 951Series; Octopart: https://octopart.com/951103-8622-ar-3m-14400669; Package: 951103-8622-AR; Lead Free: Yes; Device Class L2: Headers and Wire Housings; Temperature Range High: +125°C; ComponentLink2URL: http://multimedia.3m.com/mws/media/1400506O/3m-pin-strip-header-951-series-78-5100-2653-3.pdf; Automotive: No; Temperature: -55°C to +125°C; Number Of Rows: 1
Q1 = CMP-12801-000089-1: MOSFET PCH 60V 3A SOT223; Rds On Max: 150mR; Max Power Dissipation: 1.2W; Input Capacitance: 708pF; Continuous Drain Current (ID): 3A; Min Operating Temperature: -55°C; Mount: Surface Mount; Case/Package: TO-261-4; Packaging: Tape and Reel; Drain to Source Voltage (Vdss): 60V; Max Operating Temperature: 150°C
R2 = CMP-03412-037390-1: RES SMD 120 OHM 5% 1/8W 0805; Manufacturer: Yageo; Manufacturer Part Number: AC0805JR-07120RL; Value: 120Ω; Tolerance: 0.05; Automotive Grade: Grade 0; Voltage Rating: 150V; Ipc Land Pattern Name: RESC200125X50; Category: Res; RoHS: TRUE; Package: AC0805; Temperature Range High: +155°C; Device Class L2: Resistors; Temperature: -55°C to +155°C; Composition: Thick Film; Footprint Url: http://www.yageo.com/exep/pages/download/literatures/PYu-R_Mount_10.pdf; ComponentLink2URL: http://www.yageo.com/documents/recent/PYu-AC_51_RoHS_L_6.pdf; Device Class L1: Passive Components; Resistance: 120Ω; Height: 0.6mm; ComponentLink2Description: Datasheet; Octopart: https://octopart.com/ac0805jr-07120rl-yageo-52448213; Automotive: Yes; Digikey Description: RES SMD 120 OHM 5% 1/8W 0805; Temperature Range Low: -55°C; Lead Free: Yes; Device Class L3: Chip SMD Resistors; Series: AC; Power Rating: 1/8W; Mouser Description: Thick Film Resistors - SMD 1/8W 120ohm 5% AEC-Q200
R3 = CMP-2001-00362-1: Manufacturer: Panasonic; Part Number: ERJ-6GEYJ181V
Radj = CMP-2001-00267-5: Chip Resistor, 665 Ohm, +/- 1%, 0.125 W, -55 to 155 degC, 0805 (2012 Metric), RoHS, Tape and Reel; Manufacturer: Panasonic; Voltage Rating: 150 V; Mounting Technology: Surface Mount; ComponentLink2URL: http://industrial.panasonic.com/cdbs/www-data/pdf/RDA0000/AOA0000C86.pdf; ComponentLink1URL: http://www.panasonic.com/; PackageReference: 0805; Mount: Surface Mount; Package Quantity: 5000; Length: 2 mm; ComponentLink2Description: Datasheet; DatasheetVersion: 04/2015; Min Operating Temperature: -55 degC; PackageDescription: 2-Pin Surface Mount Device, Body 2 x 1.25 mm; ComponentLink1Description: Manufacturer URL; RoHSCompliant: true; Height: 0.6 mm; REACH SVHC: Unknown; Packaging: Tape and Reel; Max Operating Temperature: 155 degC
Rfb1 = CMP-2001-04771-1: Part Number: TNPW08053K32BEEN; Manufacturer: Vishay Dale
Rfb2 = CMP-1659-00013-4: Chip Resistor, 10 KOhm, +/- 1%, 0.125 W, -55 to 155 degC, 0805 (2012 Metric), RoHS, Tape and Reel; Manufacturer: Yageo; Voltage Rating: 150 V; Mount: Surface Mount; ComponentLink1Description: Manufacturer URL; ComponentLink2URL: http://www.yageo.com/documents/recent/PYu-RC_Group_51_RoHS_L_04.pdf; Pins: 2; Length: 2 mm; Min Operating Temperature: -55 degC; Height: 0.5 mm; Mounting Technology: Surface Mount; RoHSCompliant: true; REACH SVHC: No SVHC; ComponentLink1URL: http://www.yageo.com/; Max Operating Temperature: 155 degC; PackageReference: 0805; DatasheetVersion: Rev. 4, 02/2016; Package Quantity: 5000; Packaging: Tape and Reel; ComponentLink2Description: Datasheet; PackageDescription: 2-Pin Surface Mounted Device, Body 2 x 1.25 mm
Rsns = CMP-2001-01428-1: Part Number: RL0805FR-070R01L; Manufacturer: Yageo
Rt = CMP-2001-03921-1: Part Number: CRCW080544K2FKEA; Manufacturer: Vishay Dale
U3 = CMP-0244-00088-1: Fixed Low Drop Positive Voltage Regulator, 3.3V, 3-Pin DPAK, Tape and Reel; ComponentLink1Description: Manufacturer URL; PackageVersion: 2011; PackageReference: TO-252; ComponentLink2Description: Datasheet; ComponentLink1URL: http://www.st.com; DatasheetVersion: 1/11/2011; PackageDescription: 3-Pin Transistor Outline Package 2.28 mm Pitch, 9.7 mm Lead Span (DPAK); ComponentLink2URL: http://www.st.com/internet/com/TECHNICAL_RESOURCES/TECHNICAL_LITERATURE/DATASHEET/CD00000544.pdf
U4 = CMP-0063-01331-3: 42V Constant On-Time PFET Buck Switching Controller, 8-pin eMSOP, Pb-Free; Manufacturer: Texas Instruments; CompType: MiscPower; PowerWise: Y; PackageTopMarking: ZXTT*SVYB; PackageDescription: Molded Mini-SO, Exposed Pad, .118 x .118 x .034in Body, 8 Lead, .0256in Pitch; ComponentLink1Description: Datasheet URL; ComponentLink1URL: http://www.ti.com/general/docs/lit/getliterature.tsp?genericPartNumber=LM25085&fileType=pdf; PackageReference: DGN0008A; Code_JEDEC: MO-187-AA; RoHS: Y; PinCount: 8

## Sheet WiFi.SchDoc
size A

## Nets that join several sheets
+3V3: Microcontroller (6 pins), Peripherals (10 pins), Power Delivery (Power.1 R2.1 U3.4)
+5V: Microcontroller (D6.2 J1.1 LED1.2 R7.2), Power Delivery (D5.2)
GND: Microcontroller (15 pins), Peripherals (13 pins), Power Delivery (9 pins)
PIN_17: Microcontroller (Bootload.3 U1.17), Peripherals (U6.14)
PIN_18: Microcontroller (Bootload.2 U1.18), Peripherals (U6.15)
PIN_19: Microcontroller (Bootload.1 U1.19), Peripherals (U6.13)
VIN: Microcontroller (J2.2), Power Delivery (7 pins)
NetU1_16: Microcontroller (U1.16), Peripherals (U6.16)